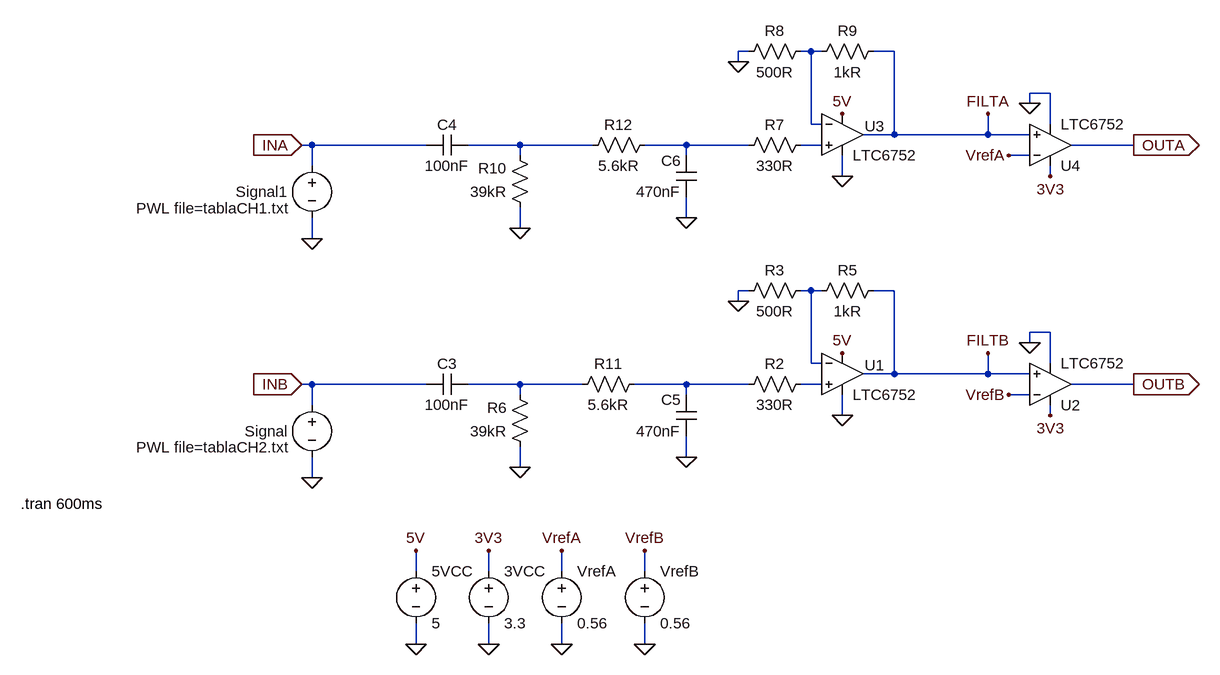
[diagram p0: schematic Sync_AmpIntegratorV2.asc]
Sync_AmpIntegratorV2.asc, the LTspice schematic file:
Version 4
SHEET 1 1964 680
WIRE 848 -384 832 -384
WIRE 944 -384 928 -384
WIRE 960 -384 944 -384
WIRE 1072 -384 1040 -384
WIRE 832 -368 832 -384
WIRE 1312 -320 1280 -320
WIRE 1280 -304 1280 -320
WIRE 944 -272 944 -384
WIRE 960 -272 944 -272
WIRE 1312 -272 1312 -320
WIRE 1072 -256 1072 -384
WIRE 1072 -256 1024 -256
WIRE 1216 -256 1216 -288
WIRE 1216 -256 1072 -256
WIRE 1280 -256 1216 -256
WIRE 176 -240 160 -240
WIRE 352 -240 176 -240
WIRE 496 -240 416 -240
WIRE 608 -240 496 -240
WIRE 752 -240 688 -240
WIRE 848 -240 752 -240
WIRE 960 -240 928 -240
WIRE 1440 -240 1344 -240
WIRE 496 -224 496 -240
WIRE 752 -224 752 -240
WIRE 1280 -224 1248 -224
WIRE 176 -208 176 -240
WIRE 992 -192 992 -224
WIRE 1312 -192 1312 -208
WIRE 752 -128 752 -160
WIRE 496 -112 496 -144
WIRE 176 -96 176 -128
WIRE 848 -16 832 -16
WIRE 944 -16 928 -16
WIRE 960 -16 944 -16
WIRE 1072 -16 1040 -16
WIRE 832 0 832 -16
WIRE 1312 48 1280 48
WIRE 1280 64 1280 48
WIRE 944 96 944 -16
WIRE 960 96 944 96
WIRE 1312 96 1312 48
WIRE 1072 112 1072 -16
WIRE 1072 112 1024 112
WIRE 1216 112 1216 80
WIRE 1216 112 1072 112
WIRE 1280 112 1216 112
WIRE 176 128 160 128
WIRE 352 128 176 128
WIRE 496 128 416 128
WIRE 592 128 496 128
WIRE 752 128 672 128
WIRE 848 128 752 128
WIRE 960 128 928 128
WIRE 1440 128 1344 128
WIRE 496 144 496 128
WIRE 752 144 752 128
WIRE 1280 144 1248 144
WIRE 176 160 176 128
WIRE 992 176 992 144
WIRE 1312 176 1312 160
WIRE 752 240 752 208
WIRE 496 256 496 224
WIRE 176 272 176 240
WIRE 336 416 336 384
WIRE 448 416 448 384
WIRE 560 416 560 384
WIRE 688 416 688 384
WIRE 336 528 336 496
WIRE 448 528 448 496
WIRE 560 528 560 496
WIRE 688 528 688 496
FLAG 176 272 0
FLAG 448 528 0
FLAG 448 384 3V3
FLAG 1280 64 0
FLAG 560 528 0
FLAG 560 384 VrefA
FLAG 688 528 0
FLAG 688 384 VrefB
FLAG 1312 176 3V3
FLAG 1248 144 VrefB
FLAG 176 -96 0
FLAG 1280 -304 0
FLAG 1312 -192 3V3
FLAG 1248 -224 VrefA
FLAG 1440 128 OUTB
IOPIN 1440 128 Out
FLAG 1440 -240 OUTA
IOPIN 1440 -240 Out
FLAG 160 -240 INA
IOPIN 160 -240 In
FLAG 160 128 INB
IOPIN 160 128 In
FLAG 1216 -288 FILTA
FLAG 1216 80 FILTB
FLAG 832 -368 0
FLAG 992 -288 5V
FLAG 992 -192 0
FLAG 832 0 0
FLAG 992 80 5V
FLAG 992 176 0
FLAG 496 256 0
FLAG 496 -112 0
FLAG 752 240 0
FLAG 752 -128 0
FLAG 336 528 0
FLAG 336 384 5V
SYMBOL voltage 176 144 R0
WINDOW 0 -37 56 Right 2
WINDOW 3 -34 81 Right 2
WINDOW 123 0 0 Left 0
WINDOW 39 0 0 Left 0
SYMATTR InstName Signal
SYMATTR Value PWL file=tablaCH2.txt
SYMBOL voltage 448 400 R0
WINDOW 123 0 0 Left 0
WINDOW 39 0 0 Left 0
SYMATTR InstName 3VCC
SYMATTR Value 3.3
SYMBOL Comparators\\LTC6752 1312 192 M180
SYMATTR InstName U2
SYMBOL voltage 560 400 R0
WINDOW 123 0 0 Left 0
WINDOW 39 0 0 Left 0
SYMATTR InstName VrefA
SYMATTR Value 0.56
SYMBOL voltage 688 400 R0
WINDOW 123 0 0 Left 0
WINDOW 39 0 0 Left 0
SYMATTR InstName VrefB
SYMATTR Value 0.56
SYMBOL voltage 176 -224 R0
WINDOW 0 -37 56 Right 2
WINDOW 3 -34 81 Right 2
WINDOW 123 0 0 Left 0
WINDOW 39 0 0 Left 0
SYMATTR InstName Signal1
SYMATTR Value PWL file=tablaCH1.txt
SYMBOL Comparators\\LTC6752 1312 -176 M180
SYMATTR InstName U4
SYMBOL res 944 -256 R90
WINDOW 0 0 56 VBottom 2
WINDOW 3 32 56 VTop 2
SYMATTR InstName R7
SYMATTR Value 330R
SYMBOL res 944 -400 R90
WINDOW 0 0 56 VBottom 2
WINDOW 3 32 56 VTop 2
SYMATTR InstName R8
SYMATTR Value 500R
SYMBOL res 1056 -400 R90
WINDOW 0 0 56 VBottom 2
WINDOW 3 32 56 VTop 2
SYMATTR InstName R9
SYMATTR Value 1kR
SYMBOL res 944 112 R90
WINDOW 0 0 56 VBottom 2
WINDOW 3 32 56 VTop 2
SYMATTR InstName R2
SYMATTR Value 330R
SYMBOL res 944 -32 R90
WINDOW 0 0 56 VBottom 2
WINDOW 3 32 56 VTop 2
SYMATTR InstName R3
SYMATTR Value 500R
SYMBOL res 1056 -32 R90
WINDOW 0 0 56 VBottom 2
WINDOW 3 32 56 VTop 2
SYMATTR InstName R5
SYMATTR Value 1kR
SYMBOL res 512 240 R180
WINDOW 0 36 76 Left 2
WINDOW 3 36 40 Left 2
SYMATTR InstName R6
SYMATTR Value 39kR
SYMBOL cap 352 144 R270
WINDOW 0 32 32 VTop 2
WINDOW 3 0 32 VBottom 2
SYMATTR InstName C3
SYMATTR Value 100nF
SYMBOL res 512 -128 R180
WINDOW 0 36 76 Left 2
WINDOW 3 36 40 Left 2
SYMATTR InstName R10
SYMATTR Value 39kR
SYMBOL cap 352 -224 R270
WINDOW 0 32 32 VTop 2
WINDOW 3 0 32 VBottom 2
SYMATTR InstName C4
SYMATTR Value 100nF
SYMBOL Comparators\\LTC6752 992 -320 R0
WINDOW 0 34 51 Left 2
SYMATTR InstName U3
SYMBOL Comparators\\LTC6752 992 48 R0
WINDOW 0 34 51 Left 2
SYMATTR InstName U1
SYMBOL res 688 112 R90
WINDOW 0 0 56 VBottom 2
WINDOW 3 32 56 VTop 2
SYMATTR InstName R11
SYMATTR Value 5.6kR
SYMBOL cap 768 208 R180
WINDOW 0 24 56 Left 2
WINDOW 3 24 8 Left 2
SYMATTR InstName C5
SYMATTR Value 470nF
SYMBOL res 704 -256 R90
WINDOW 0 0 56 VBottom 2
WINDOW 3 32 56 VTop 2
SYMATTR InstName R12
SYMATTR Value 5.6kR
SYMBOL cap 768 -160 R180
WINDOW 0 24 56 Left 2
WINDOW 3 24 8 Left 2
SYMATTR InstName C6
SYMATTR Value 470nF
SYMBOL voltage 336 400 R0
WINDOW 123 0 0 Left 0
WINDOW 39 0 0 Left 0
SYMATTR InstName 5VCC
SYMATTR Value 5
TEXT -272 312 Left 2 !.tran 600ms

The netlist it stands for:
* Sync_AmpIntegratorV2.asc
V§Signal INB 0 PWL file=tablaCH2.txt
V§3VCC 3V3 0 3.3
XU2 FILTB VrefB 3V3 0 OUTB LTC6752  ; pins In+ In- V+ V- OUT
VrefA VrefA 0 0.56
VrefB VrefB 0 0.56
V§Signal1 INA 0 PWL file=tablaCH1.txt
XU4 FILTA VrefA 3V3 0 OUTA LTC6752  ; pins In+ In- V+ V- OUT
R7 N004 N003 330R
R8 N001 0 500R
R9 FILTA N001 1kR
R2 N008 N007 330R
R3 N005 0 500R
R5 FILTB N005 1kR
R6 0 N006 39kR
C3 INB N006 100nF
R10 0 N002 39kR
C4 INA N002 100nF
XU3 N004 N001 5V 0 FILTA LTC6752  ; pins In+ In- V+ V- OUT
XU1 N008 N005 5V 0 FILTB LTC6752  ; pins In+ In- V+ V- OUT
R11 N007 N006 5.6kR
C5 0 N007 470nF
R12 N003 N002 5.6kR
C6 0 N003 470nF
V§5VCC 5V 0 5
.tran 600ms
.lib LTC7.lib
.backanno
.end